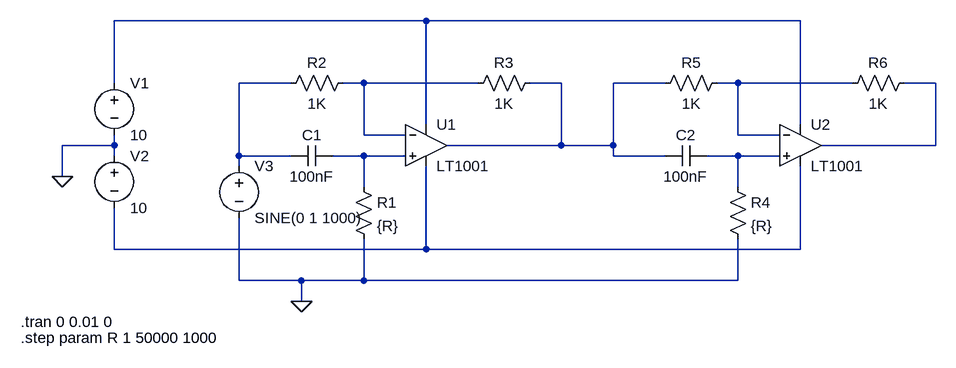
[diagram p0: schematic phase_shift_double_rc_opamp.asc]
phase_shift_double_rc_opamp.asc, the LTspice schematic file:
Version 4
SHEET 1 1204 680
WIRE 416 -80 -64 -80
WIRE 992 -80 416 -80
WIRE -64 16 -64 -80
WIRE 208 16 128 16
WIRE 320 16 288 16
WIRE 496 16 320 16
WIRE 624 16 576 16
WIRE 784 16 704 16
WIRE 896 16 864 16
WIRE 1072 16 896 16
WIRE 1200 16 1152 16
WIRE 416 80 416 -80
WIRE 992 80 992 -80
WIRE 320 96 320 16
WIRE 384 96 320 96
WIRE 896 96 896 16
WIRE 960 96 896 96
WIRE -64 112 -64 96
WIRE -64 112 -144 112
WIRE 624 112 624 16
WIRE 624 112 448 112
WIRE 704 112 704 16
WIRE 704 112 624 112
WIRE 1200 112 1200 16
WIRE 1200 112 1024 112
WIRE -64 128 -64 112
WIRE 128 128 128 16
WIRE 208 128 128 128
WIRE 320 128 272 128
WIRE 384 128 320 128
WIRE 704 128 704 112
WIRE 784 128 704 128
WIRE 896 128 848 128
WIRE 960 128 896 128
WIRE 128 144 128 128
WIRE -144 160 -144 112
WIRE 320 176 320 128
WIRE 896 176 896 128
WIRE -64 272 -64 208
WIRE 416 272 416 144
WIRE 416 272 -64 272
WIRE 992 272 992 144
WIRE 992 272 416 272
WIRE 128 320 128 224
WIRE 224 320 128 320
WIRE 320 320 320 256
WIRE 320 320 224 320
WIRE 896 320 896 256
WIRE 896 320 320 320
WIRE 224 352 224 320
FLAG -144 160 0
FLAG 224 352 0
SYMBOL Opamps\\LT1001 416 48 R0
SYMATTR InstName U1
SYMBOL voltage -64 0 R0
WINDOW 123 0 0 Left 2
WINDOW 39 0 0 Left 2
SYMATTR InstName V1
SYMATTR Value 10
SYMBOL voltage -64 112 R0
WINDOW 123 0 0 Left 2
WINDOW 39 0 0 Left 2
SYMATTR InstName V2
SYMATTR Value 10
SYMBOL res 304 160 R0
SYMATTR InstName R1
SYMATTR Value {R}
SYMBOL cap 272 112 R90
WINDOW 0 0 32 VBottom 2
WINDOW 3 32 32 VTop 2
SYMATTR InstName C1
SYMATTR Value 100nF
SYMBOL res 304 0 R90
WINDOW 0 0 56 VBottom 2
WINDOW 3 32 56 VTop 2
SYMATTR InstName R2
SYMATTR Value 1K
SYMBOL res 592 0 R90
WINDOW 0 0 56 VBottom 2
WINDOW 3 32 56 VTop 2
SYMATTR InstName R3
SYMATTR Value 1K
SYMBOL voltage 128 128 R0
WINDOW 123 0 0 Left 2
WINDOW 39 0 0 Left 2
SYMATTR InstName V3
SYMATTR Value SINE(0 1 1000)
SYMBOL Opamps\\LT1001 992 48 R0
SYMATTR InstName U2
SYMBOL res 880 160 R0
SYMATTR InstName R4
SYMATTR Value {R}
SYMBOL cap 848 112 R90
WINDOW 0 0 32 VBottom 2
WINDOW 3 32 32 VTop 2
SYMATTR InstName C2
SYMATTR Value 100nF
SYMBOL res 880 0 R90
WINDOW 0 0 56 VBottom 2
WINDOW 3 32 56 VTop 2
SYMATTR InstName R5
SYMATTR Value 1K
SYMBOL res 1168 0 R90
WINDOW 0 0 56 VBottom 2
WINDOW 3 32 56 VTop 2
SYMATTR InstName R6
SYMATTR Value 1K
TEXT -208 384 Left 2 !.tran 0 0.01 0
TEXT -208 408 Left 2 !.step param R 1 50000 1000

The netlist it stands for:
* phase_shift_double_rc_opamp.asc
XU1 N007 N003 N001 N009 N004 LT1001  ; pins In+ In- V+ V- OUT
V1 N001 0 10
V2 0 N009 10
R1 N007 0 {R}
C1 N007 N002 100nF
R2 N003 N002 1K
R3 N004 N003 1K
V3 N002 0 SINE(0 1 1000)
XU2 N008 N005 N001 N009 N006 LT1001  ; pins In+ In- V+ V- OUT
R4 N008 0 {R}
C2 N008 N004 100nF
R5 N005 N004 1K
R6 N006 N005 1K
.tran 0 0.01 0
.step param R 1 50000 1000
.lib LTC.lib
.backanno
.end